# Altium project pmod-pass-thru-UNIVERSAL.PrjPcb
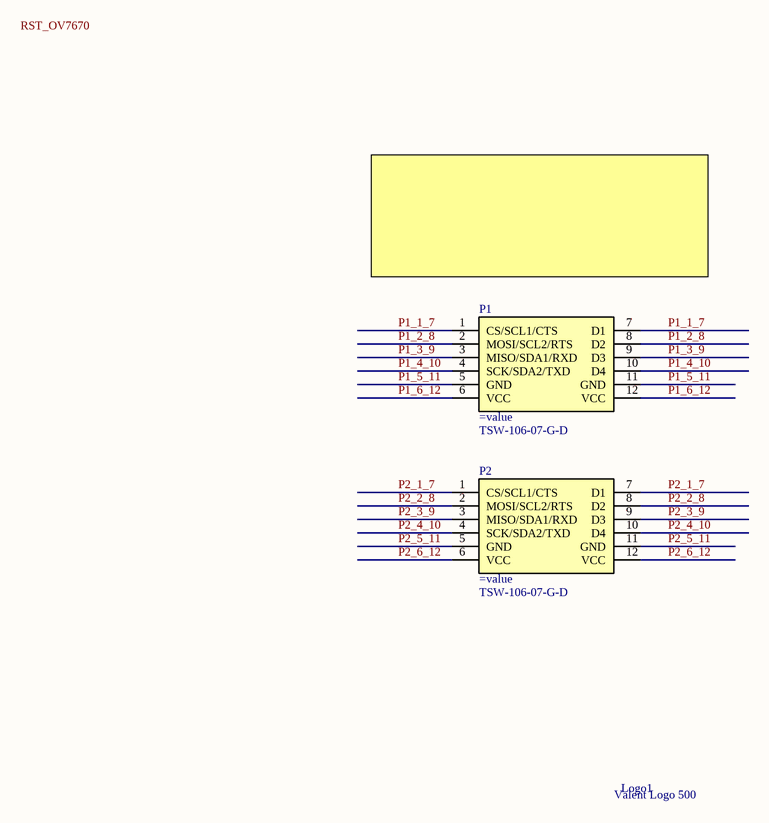
[diagram p0: pmod-pass-thru-UNIVERSAL.SchDoc]
1 sheet, 3 parts. Net scope: global (net labels, ports and power ports of the same name join across sheets).
Board file: pmod-pass-thru-UNIVERSAL.PcbDoc

## Sheet pmod-pass-thru-UNIVERSAL.SchDoc: LOGI-Bone PMOD  Loopback
size A; Engineer: Michael Jones; Revision: RA.1

### Parts
Logo1  Valent Logo 500  [VALENTFX_500-SolderMask]
P1  Supplier Part Number 1: TSW-106-07-G-D  [PMOD-S-TSW-106-07-G-D]
P2  Supplier Part Number 1: TSW-106-07-G-D  [PMOD-S-TSW-106-07-G-D]

### Nets
P1_1_7: P1.1(CS/SCL1/CTS) P1.7(D1)
P1_2_8: P1.2(MOSI/SCL2/RTS) P1.8(D2)
P1_3_9: P1.3(MISO/SDA1/RXD) P1.9(D3)
P1_4_10: P1.4(SCK/SDA2/TXD) P1.10(D4)
P1_5_11: P1.5(GND) P1.11(GND)
P1_6_12: P1.6(VCC) P1.12(VCC)
P2_1_7: P2.1(CS/SCL1/CTS) P2.7(D1)
P2_2_8: P2.2(MOSI/SCL2/RTS) P2.8(D2)
P2_3_9: P2.3(MISO/SDA1/RXD) P2.9(D3)
P2_4_10: P2.4(SCK/SDA2/TXD) P2.10(D4)
P2_5_11: P2.5(GND) P2.11(GND)
P2_6_12: P2.6(VCC) P2.12(VCC)

### Notes on the sheet
- Labels drawn without touching a wire or pin: RST_OV7670
- Title
- Revision:
- Sheet
- of
- Date:
- Engineer:

### Library data of the parts
P1 P2 = PMOD-S-TSW-106-07-G-D: Conn Unshrouded Header Straight HDR 12 POS 2.54mm Solder ST Thru-Hole Bulk; Manufacturer: Samtec; Supplier 1: Arrow; Manufacturer Part Number: TSW-106-07-G-D; RoHS: eurohs: Compliant / cnrohs: Compliant; Category: Headers & PCB Receptacles; Stock 1: 2; Pricing 1: 1=0.4726 (); Package Quantity: 1; ComponentLink1URL: http://parts.arrow.com/item/detail/samtec/tsw-106-07-g-d; ComponentLink1Description: http://parts.arrow.com/item/detail/samtec/tsw-106-07-g-d